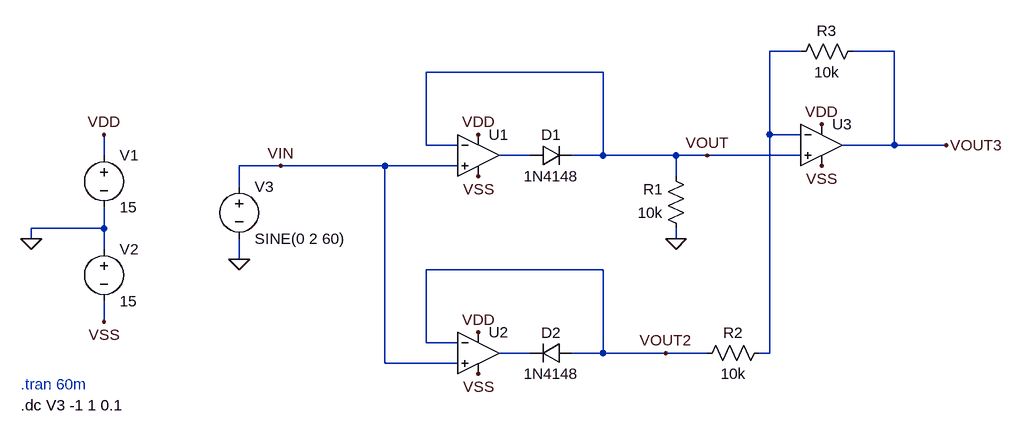
[diagram p0: schematic Lab2Part4Q9.asc]
Lab2Part4Q9.asc, the LTspice schematic file:
Version 4
SHEET 1 1328 680
WIRE 1008 -64 960 -64
WIRE 1152 -64 1088 -64
WIRE 704 -32 432 -32
WIRE 960 64 960 -64
WIRE 1008 64 960 64
WIRE 432 80 432 -32
WIRE 480 80 432 80
WIRE 1152 80 1152 -64
WIRE 1152 80 1072 80
WIRE 1232 80 1152 80
WIRE -64 96 -64 64
WIRE 592 96 544 96
WIRE 704 96 704 -32
WIRE 704 96 656 96
WIRE 816 96 704 96
WIRE 864 96 816 96
WIRE 1008 96 864 96
WIRE 208 112 144 112
WIRE 368 112 208 112
WIRE 480 112 368 112
WIRE 816 128 816 96
WIRE 144 144 144 112
WIRE -64 208 -64 176
WIRE -64 208 -176 208
WIRE -176 224 -176 208
WIRE 816 224 816 208
WIRE -64 240 -64 208
WIRE 144 256 144 224
WIRE 704 272 432 272
WIRE -64 352 -64 320
WIRE 432 384 432 272
WIRE 480 384 432 384
WIRE 592 400 544 400
WIRE 704 400 704 272
WIRE 704 400 656 400
WIRE 800 400 704 400
WIRE 864 400 800 400
WIRE 960 400 960 64
WIRE 960 400 944 400
WIRE 368 416 368 112
WIRE 480 416 368 416
FLAG -176 224 0
FLAG -64 352 VSS
FLAG -64 64 VDD
FLAG 512 128 VSS
FLAG 512 64 VDD
FLAG 816 224 0
FLAG 864 96 VOUT
FLAG 144 256 0
FLAG 208 112 VIN
FLAG 512 432 VSS
FLAG 512 368 VDD
FLAG 800 400 VOUT2
FLAG 1040 112 VSS
FLAG 1040 48 VDD
FLAG 1232 80 VOUT3
SYMBOL voltage -64 80 R0
WINDOW 123 0 0 Left 0
WINDOW 39 0 0 Left 0
SYMATTR InstName V1
SYMATTR Value 15
SYMBOL voltage -64 224 R0
WINDOW 123 0 0 Left 0
WINDOW 39 0 0 Left 0
SYMATTR InstName V2
SYMATTR Value 15
SYMBOL OpAmps\\UniversalOpAmp2 512 96 R0
SYMATTR InstName U1
SYMBOL diode 592 112 R270
WINDOW 0 32 32 VTop 2
WINDOW 3 0 32 VBottom 2
SYMATTR InstName D1
SYMATTR Value 1N4148
SYMBOL res 832 224 R180
WINDOW 0 36 76 Left 2
WINDOW 3 36 40 Left 2
SYMATTR InstName R1
SYMATTR Value 10k
SYMBOL OpAmps\\UniversalOpAmp2 512 400 R0
SYMATTR InstName U2
SYMBOL diode 656 384 R90
WINDOW 0 0 32 VBottom 2
WINDOW 3 32 32 VTop 2
SYMATTR InstName D2
SYMATTR Value 1N4148
SYMBOL res 848 416 R270
WINDOW 0 32 56 VTop 2
WINDOW 3 0 56 VBottom 2
SYMATTR InstName R2
SYMATTR Value 10k
SYMBOL OpAmps\\UniversalOpAmp2 1040 80 R0
SYMATTR InstName U3
SYMBOL res 992 -48 R270
WINDOW 0 32 56 VTop 2
WINDOW 3 0 56 VBottom 2
SYMATTR InstName R3
SYMATTR Value 10k
SYMBOL voltage 144 128 R0
WINDOW 123 0 0 Left 0
WINDOW 39 0 0 Left 0
SYMATTR InstName V3
SYMATTR Value SINE(0 2 60)
TEXT -192 448 Left 2 ;.tran 60m
TEXT -192 480 Left 2 !.dc V3 -1 1 0.1

The netlist it stands for:
* Lab2Part4Q9.asc
V1 VDD 0 15
V2 0 VSS 15
XU1 VIN VOUT VDD VSS N002 level2 Avol=1Meg GBW=10Meg Slew=10Meg Ilimit=25m Rail=0 Vos=0 En=0 Enk=0 In=0 Ink=0 Rin=500Meg  ; pins In+ In- V+ V- OUT
D1 N002 VOUT 1N4148
R1 0 VOUT 10k
XU2 VIN VOUT2 VDD VSS N003 level2 Avol=1Meg GBW=10Meg Slew=10Meg Ilimit=25m Rail=0 Vos=0 En=0 Enk=0 In=0 Ink=0 Rin=500Meg  ; pins In+ In- V+ V- OUT
D2 VOUT2 N003 1N4148
R2 VOUT2 N001 10k
XU3 VOUT N001 VDD VSS VOUT3 level2 Avol=1Meg GBW=10Meg Slew=10Meg Ilimit=25m Rail=0 Vos=0 En=0 Enk=0 In=0 Ink=0 Rin=500Meg  ; pins In+ In- V+ V- OUT
R3 N001 VOUT3 10k
V3 VIN 0 SINE(0 2 60)
.model D D
.lib standard.dio
* .tran 60m
.dc V3 -1 1 0.1
.lib UniversalOpAmp2.lib
.backanno
.end

* Results of the author's LTspice run, read from the files saved beside the schematic
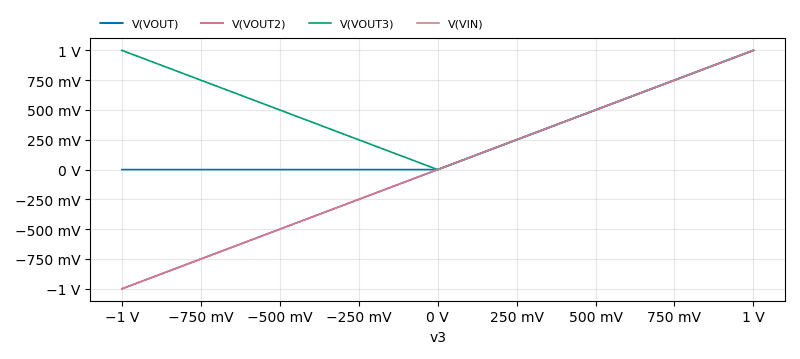
[diagram p1: DC transfer characteristic of Lab2Part4Q9.asc, plotted from the saved traces]
* DC transfer characteristic, 1 run:
*   V(VOUT): -25.35 µV at v3=-1 V, 1 V at v3=1 V, min -25.35 µV, max 1 V
*   V(VOUT2): -1 V at v3=-1 V, 1 V at v3=1 V, min -1 V, max 1 V
*   V(VOUT3): 999.9 mV at v3=-1 V, 1 V at v3=1 V, min -0.1549 fV, max 1 V
*   V(VIN): -1 V at v3=-1 V, 1 V at v3=1 V, min -1 V, max 1 V